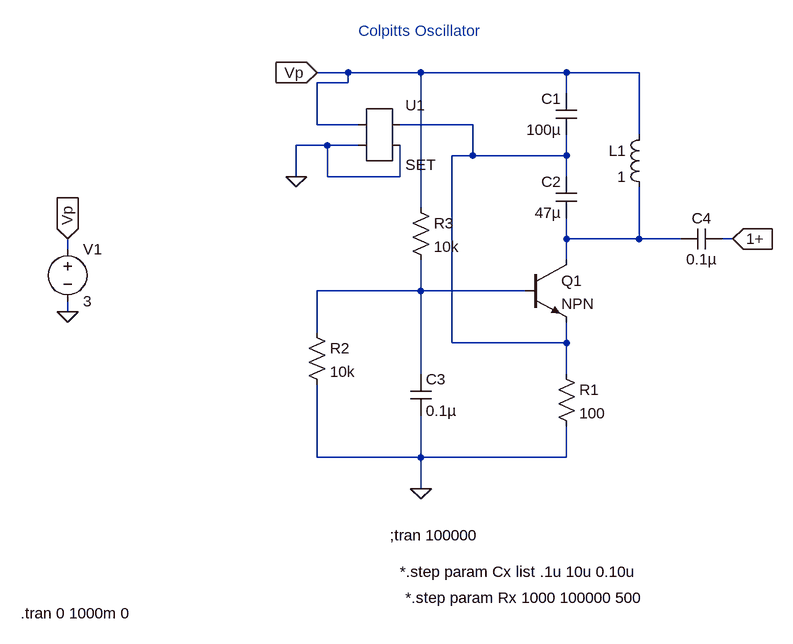
[diagram p0: schematic colpitsconset.asc]
colpitsconset.asc, the LTspice schematic file:
Version 4
SHEET 1 880 784
WIRE -544 -288 -592 -288
WIRE -432 -288 -544 -288
WIRE -208 -288 -432 -288
WIRE -96 -288 -208 -288
WIRE -544 -272 -544 -288
WIRE -544 -272 -592 -272
WIRE -208 -256 -208 -288
WIRE -592 -208 -592 -272
WIRE -528 -208 -592 -208
WIRE -352 -208 -464 -208
WIRE -96 -192 -96 -288
WIRE -576 -176 -624 -176
WIRE -528 -176 -576 -176
WIRE -352 -160 -352 -208
WIRE -352 -160 -384 -160
WIRE -208 -160 -208 -192
WIRE -208 -160 -352 -160
WIRE -624 -128 -624 -176
WIRE -576 -128 -576 -176
WIRE -464 -128 -464 -176
WIRE -464 -128 -576 -128
WIRE -208 -128 -208 -160
WIRE -432 -80 -432 -288
WIRE -208 -32 -208 -64
WIRE -96 -32 -96 -112
WIRE -96 -32 -208 -32
WIRE -32 -32 -96 -32
WIRE 48 -32 32 -32
WIRE -976 -16 -976 -32
WIRE -208 0 -208 -32
WIRE -432 48 -432 0
WIRE -432 48 -592 48
WIRE -272 48 -432 48
WIRE -976 80 -976 64
WIRE -592 112 -592 48
WIRE -384 128 -384 -160
WIRE -208 128 -208 96
WIRE -208 128 -384 128
WIRE -432 176 -432 48
WIRE -208 176 -208 128
WIRE -592 304 -592 192
WIRE -432 304 -432 240
WIRE -432 304 -592 304
WIRE -208 304 -208 256
WIRE -208 304 -432 304
WIRE -432 352 -432 304
FLAG 48 -32 1+
IOPIN 48 -32 In
FLAG -592 -288 Vp
IOPIN -592 -288 In
FLAG -976 80 0
FLAG -976 -32 Vp
IOPIN -976 -32 In
FLAG -432 352 0
FLAG -624 -128 0
SYMBOL cap -448 176 R0
SYMATTR InstName C3
SYMATTR Value 0.1µ
SYMBOL cap 32 -48 R90
WINDOW 0 0 32 VBottom 2
WINDOW 3 32 32 VTop 2
SYMATTR InstName C4
SYMATTR Value 0.1µ
SYMBOL voltage -976 -32 R0
WINDOW 123 0 0 Left 0
WINDOW 39 0 0 Left 0
SYMATTR InstName V1
SYMATTR Value 3
SYMBOL cap -192 -256 M0
SYMATTR InstName C1
SYMATTR Value 100µ
SYMBOL cap -192 -128 M0
SYMATTR InstName C2
SYMATTR Value 47µ
SYMBOL ind -80 -208 M0
SYMATTR InstName L1
SYMATTR Value 1
SYMBOL res -224 160 R0
SYMATTR InstName R1
SYMATTR Value 100
SYMBOL res -608 96 R0
SYMATTR InstName R2
SYMATTR Value 10k
SYMBOL npn -272 0 R0
SYMATTR InstName Q1
SYMBOL AutoGenerated\\SET -496 -192 R0
SYMATTR InstName U1
SYMBOL res -448 -96 R0
SYMATTR InstName R3
SYMATTR Value 10k
TEXT -528 -352 Left 2 ;Colpitts Oscillator
TEXT -480 424 Left 2 !;tran 100000
TEXT -464 480 Left 2 !*.step param Cx list .1u 10u 0.10u
TEXT -456 520 Left 2 !*.step param Rx 1000 100000 500
TEXT -1048 544 Left 2 !.tran 0 1000m 0

The netlist it stands for:
* colpitsconset.asc
C3 N003 0 0.1µ
C4 1+ N002 0.1µ
V1 Vp 0 3
C1 Vp N001 100µ
C2 N001 N002 47µ
L1 Vp N002 1
R1 N001 0 100
R2 N003 0 10k
Q1 N002 N003 N001 0 NPN
* U1: SET (symbol AutoGenerated\SET not available, pins judged from their places): pin1=Vp pin2=0 pin3=N001 pin4=0
R3 Vp N003 10k
.model NPN NPN
.model PNP PNP
.lib standard.bjt
* Colpitts Oscillator
;tran 100000
*.step param Cx list .1u 10u 0.10u
*.step param Rx 1000 100000 500
.tran 0 1000m 0
.backanno
.end